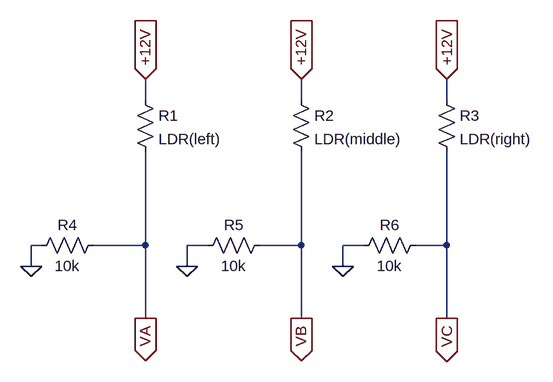
[diagram p0: schematic sensing unit.asc]
sensing unit.asc, the LTspice schematic file:
Version 4
SHEET 1 880 680
WIRE -272 -576 -272 -608
WIRE -32 -576 -32 -608
WIRE 192 -576 192 -608
WIRE -432 -352 -448 -352
WIRE -272 -352 -272 -496
WIRE -272 -352 -352 -352
WIRE -176 -352 -208 -352
WIRE -32 -352 -32 -496
WIRE -32 -352 -96 -352
WIRE 64 -352 32 -352
WIRE 192 -352 192 -496
WIRE 192 -352 144 -352
WIRE -448 -320 -448 -352
WIRE -208 -320 -208 -352
WIRE 32 -320 32 -352
WIRE -272 -240 -272 -352
WIRE -32 -240 -32 -352
WIRE 192 -240 192 -352
FLAG -448 -320 0
FLAG -208 -320 0
FLAG 32 -320 0
FLAG -272 -240 VA
IOPIN -272 -240 Out
FLAG -32 -240 VB
IOPIN -32 -240 Out
FLAG 192 -240 VC
IOPIN 192 -240 Out
FLAG -272 -608 +12V
IOPIN -272 -608 In
FLAG -32 -608 +12V
IOPIN -32 -608 In
FLAG 192 -608 +12V
IOPIN 192 -608 In
SYMBOL res -288 -592 R0
SYMATTR InstName R1
SYMATTR Value LDR(left)
SYMBOL res -48 -592 R0
SYMATTR InstName R2
SYMATTR Value LDR(middle)
SYMBOL res 176 -592 R0
SYMATTR InstName R3
SYMATTR Value LDR(right)
SYMBOL res -336 -368 R90
WINDOW 0 0 56 VBottom 2
WINDOW 3 32 56 VTop 2
SYMATTR InstName R4
SYMATTR Value 10k
SYMBOL res -80 -368 R90
WINDOW 0 0 56 VBottom 2
WINDOW 3 32 56 VTop 2
SYMATTR InstName R5
SYMATTR Value 10k
SYMBOL res 160 -368 R90
WINDOW 0 0 56 VBottom 2
WINDOW 3 32 56 VTop 2
SYMATTR InstName R6
SYMATTR Value 10k

The netlist it stands for:
* sensing unit.asc
R1 +12V VA LDR(left)
R2 +12V VB LDR(middle)
R3 +12V VC LDR(right)
R4 VA 0 10k
R5 VB 0 10k
R6 VC 0 10k
.backanno
.end